# Altium schematic sheet nlf15-main_controller.SchDoc
size A4
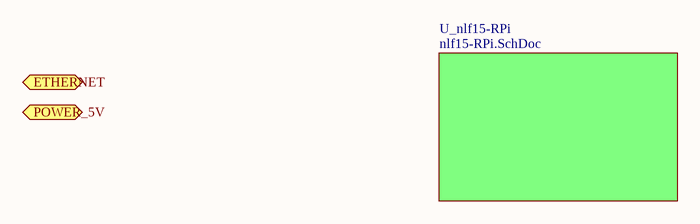
[diagram p0: nlf15-main_controller.SchDoc]

## Sub-sheets
U_nlf15-RPi = nlf15-RPi.SchDoc: no entries

## Ports
ETHERNET (harness ETHERNET-Harness), POWER_5V (harness POWER_5V-Harness)